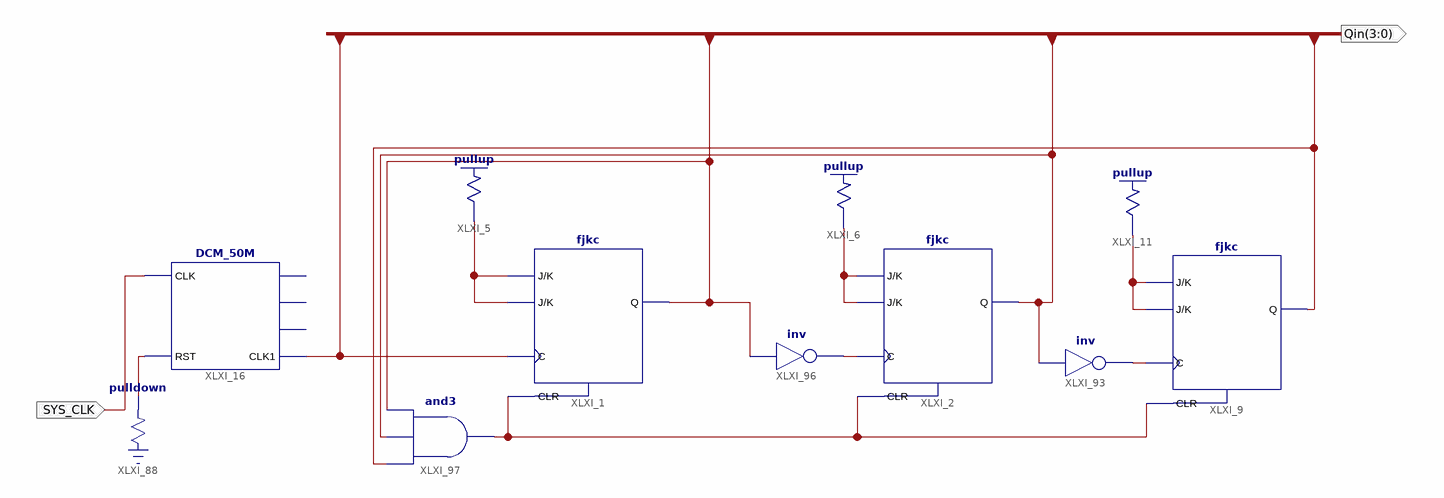
[diagram p0: schematic sheet 1]
// Xilinx ISE schematic Experiment3.sch (spartan3e) as structural Verilog: 11 symbols, 2 ports
module Experiment3 (
  input  SYS_CLK,
  output [3:0] Qin
);

  wire XLXN_3, XLXN_4, XLXN_11, XLXN_371, XLXN_392, XLXN_406, XLXN_407;

  \pullup  XLXI_11 (.O(XLXN_11));
  \pullup  XLXI_6 (.O(XLXN_4));
  \pullup  XLXI_5 (.O(XLXN_3));
  DCM_50M XLXI_16 (.CLK(SYS_CLK), .RST(XLXN_371), .CLK1(Qin[0]));  // open: CLK1M, CLK10k, CLK1k
  fjkc XLXI_9 (.C(XLXN_407), .CLR(XLXN_392), .J(XLXN_11), .K(XLXN_11), .Q(Qin[3]));
  fjkc XLXI_2 (.C(XLXN_406), .CLR(XLXN_392), .J(XLXN_4), .K(XLXN_4), .Q(Qin[2]));
  \pulldown  XLXI_88 (.O(XLXN_371));
  fjkc XLXI_1 (.C(Qin[0]), .CLR(XLXN_392), .J(XLXN_3), .K(XLXN_3), .Q(Qin[1]));
  not XLXI_93 (XLXN_407, Qin[2]);
  not XLXI_96 (XLXN_406, Qin[1]);
  and XLXI_97 (XLXN_392, Qin[3], Qin[2], Qin[1]);
endmodule
